# Altium project carte_alim.PrjPCB
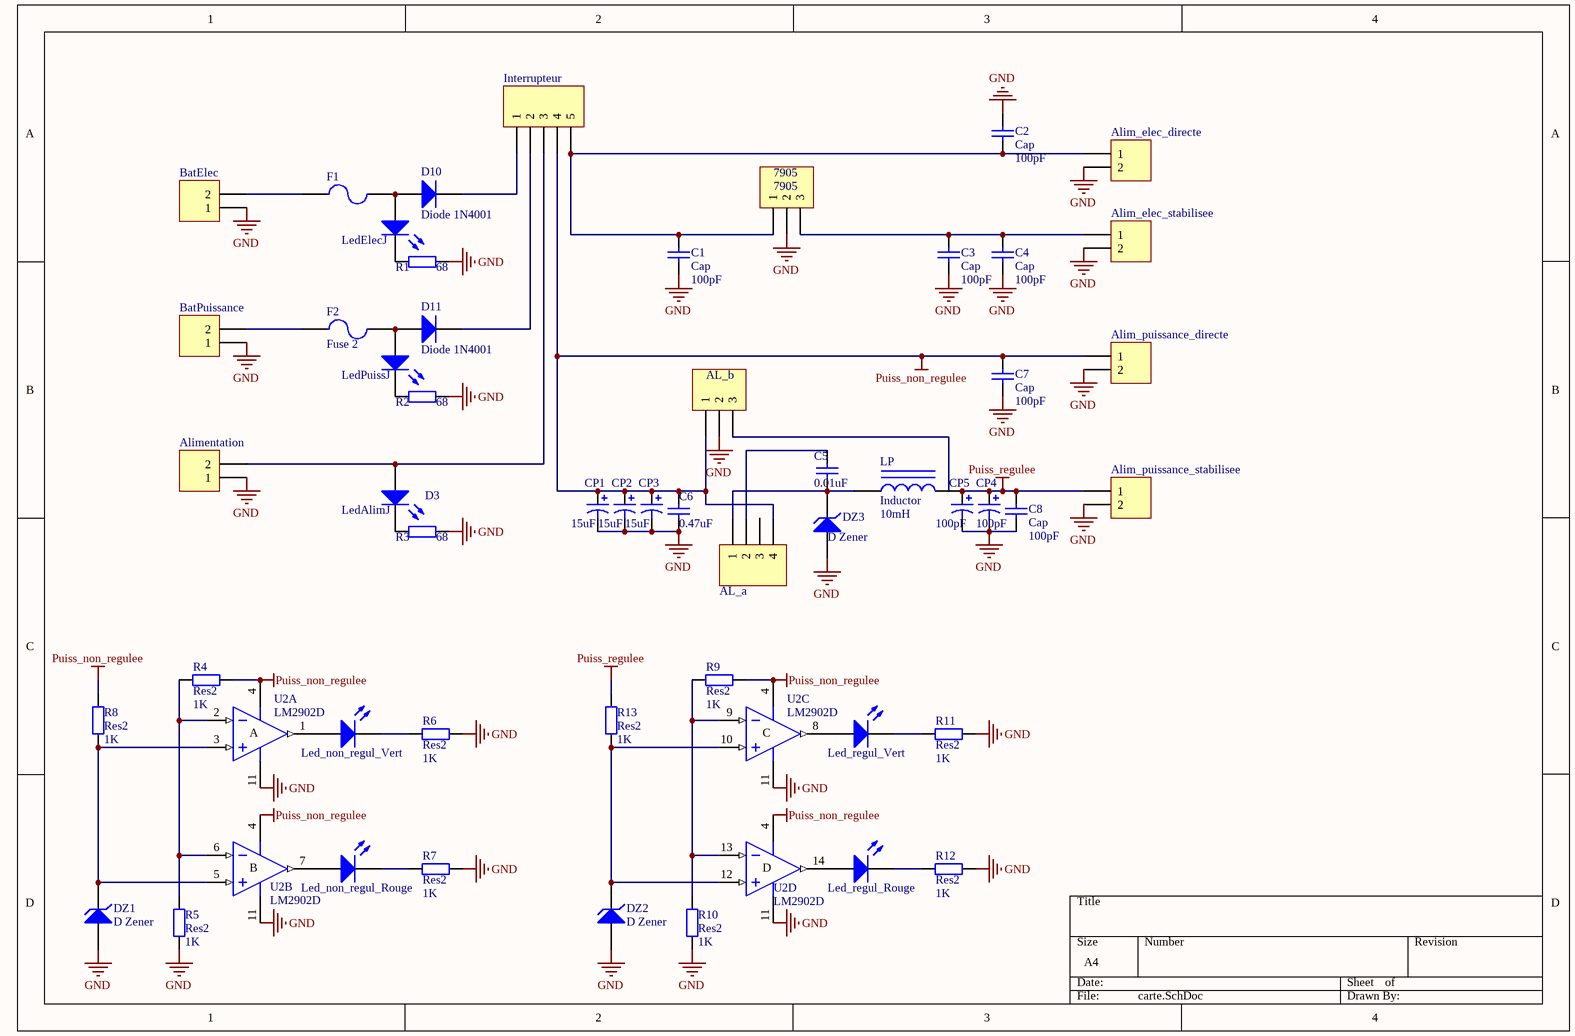
[diagram p0: carte.SchDoc]
1 sheet, 53 parts. Net scope: global (net labels, ports and power ports of the same name join across sheets).

## Sheet carte.SchDoc
size A4

### Parts
7905  7905  [MHDR1X3]
AL_a  Header 4  [HDR1X4]  (value not drawn)
AL_b  Header 3  [HDR1X3]  (value not drawn)
Alim_elec_directe  Header 2  [HDR1X2]  (value not drawn)
Alim_elec_stabilisee  Header 2  [HDR1X2]  (value not drawn)
Alim_puissance_directe  Header 2  [HDR1X2]  (value not drawn)
Alim_puissance_stabilisee  Header 2  [HDR1X2]  (value not drawn)
Alimentation  Header 2  [HDR1X2]  (value not drawn)
BatElec  Header 2  [HDR1X2]  (value not drawn)
BatPuissance  Header 2  [HDR1X2]  (value not drawn)
C1  Cap  value 100pF  [RAD-0.3]
C2  Cap  value 100pF  [RAD-0.3]
C3  Cap  value 100pF  [RAD-0.3]
C4  Cap  value 100pF  [RAD-0.3]
C5  value 0.01uF  [RAD-0.3]  (hidden comment: Cap)
C6  value 0.47uF  [RAD-0.3]  (hidden comment: Cap)
C7  Cap  value 100pF  [RAD-0.3]
C8  Cap  value 100pF  [RAD-0.3]
CP1  value 15uF  [RB7.6-15]  (hidden comment: Cap Pol1)
CP2  value 15uF  [RB7.6-15]  (hidden comment: Cap Pol1)
CP3  value 15uF  [RB7.6-15]  (hidden comment: Cap Pol1)
CP4  value 100pF  [RB7.6-15]  (hidden comment: Cap Pol1)
CP5  value 100pF  [RB7.6-15]  (hidden comment: Cap Pol1)
D3  LedAlimJ  [LED-1]
D10  Diode 1N4001  [DO-41]
D11  Diode 1N4001  [DO-41]
DZ1  D Zener  [DIODE-0.7]
DZ2  D Zener  [DIODE-0.7]
DZ3  D Zener  [DIODE-0.7]
F1  Fuse 2  [PIN-W2/E2.8]  (value not drawn)
F2  Fuse 2  [PIN-W2/E2.8]
Interrupteur  Header 5  [HDR1X5]  (value not drawn)
Led_non_regul_Rouge  LED1  [LED-1]  (value not drawn)
Led_non_regul_Vert  LED1  [LED-1]  (value not drawn)
Led_regul_Rouge  LED1  [LED-1]  (value not drawn)
Led_regul_Vert  LED1  [LED-1]  (value not drawn)
LedElecJ  LED1  [LED-1]  (value not drawn)
LedPuissJ  LED1  [LED-1]  (value not drawn)
LP  Inductor  value 10mH  [AXIAL-0.9]
R1  value 68  [AXIAL-0.4]  (hidden comment: Res2)
R2  value 68  [AXIAL-0.4]  (hidden comment: Res2)
R3  value 68  [AXIAL-0.4]  (hidden comment: Res2)
R4  Res2  value 1K  [AXIAL-0.4]
R5  Res2  value 1K  [AXIAL-0.4]
R6  Res2  value 1K  [AXIAL-0.4]
R7  Res2  value 1K  [AXIAL-0.4]
R8  Res2  value 1K  [AXIAL-0.4]
R9  Res2  value 1K  [AXIAL-0.4]
R10  Res2  value 1K  [AXIAL-0.4]
R11  Res2  value 1K  [AXIAL-0.4]
R12  Res2  value 1K  [AXIAL-0.4]
R13  Res2  value 1K  [AXIAL-0.4]
U2  LM2902D  [D014_N]  (parts A,B,C,D of 4)

### Nets
GND: 7905.2 AL_b.2 Alim_elec_directe.2 Alim_elec_stabilisee.2 Alim_puissance_directe.2 Alim_puissance_stabilisee.2 Alimentation.1 BatElec.1 BatPuissance.1 C1.1 C2.2 C3.1 C4.1 C6.1 C7.1 C8.1 CP1.2 CP2.2 CP3.2 CP4.2 CP5.2 DZ1.1(A) DZ2.1(A) DZ3.1(A) R1.2 R2.2 R3.2 R5.1 R6.2 R7.2 R10.1 R11.2 R12.2 U2.11(V-)
Puiss_non_regulee: AL_a.1(4) AL_b.1 Alim_puissance_directe.1 C6.2 C7.2 CP1.1 CP2.1 CP3.1 Interrupteur.4 R4.1 R8.2 R9.1 U2.4(V+)
Puiss_regulee: Alim_puissance_stabilisee.1 C8.2 CP4.1 CP5.1 LP.2 R13.2
Net7905_1: 7905.1 Alim_elec_directe.1 C1.2 C2.1 Interrupteur.5
Net7905_3: 7905.3 Alim_elec_stabilisee.1 C3.2 C4.2
NetAL_a_3: AL_a.3(2) C5.2
NetAL_a_4: AL_a.4(1) C5.1 DZ3.2(K) LP.1
NetAlimentation_2: Alimentation.2 D3.1(A) Interrupteur.3
NetBatElec_2: BatElec.2 F1.1
NetBatPuissance_2: BatPuissance.2 F2.1
NetD3_2: D3.2(K) R3.1
NetD10_1: D10.1(A) F1.2 LedElecJ.1(A)
NetD10_2: D10.2(K) Interrupteur.1
NetD11_1: D11.1(A) F2.2 LedPuissJ.1(A)
NetD11_2: D11.2(K) Interrupteur.2
NetDZ1_2: DZ1.2(K) R8.1 U2.3(IN+) U2.5(IN+)
NetDZ2_2: DZ2.2(K) R13.1 U2.10(IN+) U2.12(IN+)
NetLed_non_regul_Rouge_1: Led_non_regul_Rouge.1(A) U2.7(OUT)
NetLed_non_regul_Rouge_2: Led_non_regul_Rouge.2(K) R7.1
NetLed_non_regul_Vert_1: Led_non_regul_Vert.1(A) U2.1(OUT)
NetLed_non_regul_Vert_2: Led_non_regul_Vert.2(K) R6.1
NetLed_regul_Rouge_1: Led_regul_Rouge.1(A) U2.14(OUT)
NetLed_regul_Rouge_2: Led_regul_Rouge.2(K) R12.1
NetLed_regul_Vert_1: Led_regul_Vert.1(A) U2.8(OUT)
NetLed_regul_Vert_2: Led_regul_Vert.2(K) R11.1
NetLedElecJ_2: LedElecJ.2(K) R1.1
NetLedPuissJ_2: LedPuissJ.2(K) R2.1
NetR4_2: R4.2 R5.2 U2.2(IN-) U2.6(IN-)
NetR9_2: R9.2 R10.2 U2.9(IN-) U2.13(IN-)

Not connected (* = marked no-connect by the designer): AL_a 2(3); AL_b 3

### Notes on the sheet
- (in symbol LM2902D, part A) A
- (in symbol LM2902D, part B) B
- (in symbol LM2902D, part C) C
- (in symbol LM2902D, part D) D

### Library data of the parts
7905 = MHDR1X3: Header, 3-Pin; LatestRevisionDate: 17-Jul-2002; LatestRevisionNote: Re-released for DXP Platform.; Publisher: Altium Limited
AL_a = Header 4: Header, 4-Pin; LatestRevisionDate: 17-Jul-2002; LatestRevisionNote: Re-released for DXP Platform.; Publisher: Altium Limited
AL_b = Header 3: Header, 3-Pin; LatestRevisionDate: 17-Jul-2002; LatestRevisionNote: Re-released for DXP Platform.; Publisher: Altium Limited
Alim_elec_directe Alim_elec_stabilisee Alim_puissance_directe Alim_puissance_stabilisee Alimentation BatElec BatPuissance = Header 2: Header, 2-Pin; LatestRevisionDate: 17-Jul-2002; LatestRevisionNote: Re-released for DXP Platform.; Publisher: Altium Limited
C1-C8 = Cap: Capacitor; Published: 8-Jun-2000; LatestRevisionDate: 17-Jul-2002; LatestRevisionNote: Re-released for DXP Platform.; PackageReference: RAD-0.3; Publisher: Altium Limited; PackageDescription: Radial Cap, Thru-Hole; 2 Leads; 0.3 in Pin Spacing
CP1-CP5 = Cap Pol1: Polarized Capacitor (Radial); Published: 8-Jun-2000; LatestRevisionDate: 17-Jul-2002; LatestRevisionNote: Re-released for DXP Platform.; PackageReference: RB7.6-15; Publisher: Altium Limited; PackageDescription: Polarized Capacitor (Radial); 2 Leads
D3 Led_non_regul_Rouge Led_non_regul_Vert Led_regul_Rouge Led_regul_Vert LedElecJ LedPuissJ = LED1: Typical RED GaAs LED; Published: 8-Jun-2000; LatestRevisionDate: 08-Jul-2005; LatestRevisionNote: Mech Layer 1 removed.; PackageReference: LED-1; Publisher: Altium Limited; PackageDescription: LED; 2 Leads
D10 D11 = Diode 1N4001: 1 Amp General Purpose Rectifier; Published: 8-Jun-2000; LatestRevisionDate: 17-Jul-2002; LatestRevisionNote: Re-released for DXP Platform.; DatasheetVersion: 1998; PackageVersion: Aug-1999; PackageReference: DO-41; Publisher: Altium Limited; PackageDescription: Diode, Axial; Body 5.2 x 2.7 mm (LxDia. max), Lead Dia. 0.86 mm (max); Code_JEDEC: DO-204-AL; ComponentLink1Description: Manufacturer Link; ComponentLink1URL: http://www.fairchildsemi.com/; ComponentLink2Description: Datasheet; ComponentLink2URL: http://www.fairchildsemi.com/ds/1N%2F1N4001.pdf
DZ1-DZ3 = D Zener: Zener Diode; Published: 8-Jun-2000; LatestRevisionDate: 17-Jul-2002; LatestRevisionNote: Re-released for DXP Platform.; PackageReference: DIODE-0.7; Publisher: Altium Limited; PackageDescription: Diode, Thru-Hole; 2 Leads; 0.7 in Pin Spacing
F1 F2 = Fuse 2: Fuse; Published: 8-Jun-2000; LatestRevisionDate: 17-Jul-2002; LatestRevisionNote: Re-released for DXP Platform.; PackageReference: PIN-W2/E2.8; Publisher: Altium Limited; PackageDescription: Thru-Hole; 2 Leads
Interrupteur = Header 5: Header, 5-Pin; LatestRevisionDate: 17-Jul-2002; LatestRevisionNote: Re-released for DXP Platform.; Publisher: Altium Limited
LP = Inductor Iron: Magnetic-Core Inductor; Published: 24-Mar-1999; LatestRevisionDate: 17-Jul-2002; LatestRevisionNote: Re-released for DXP Platform.; PackageReference: AXIAL-0.9; Publisher: Altium Limited; PackageDescription: Axial Device, Thru-Hole; 2 Leads; 0.9 in Pin Spacing
R1-R13 = Res2: Resistor; Published: 8-Jun-2000; LatestRevisionDate: 17-Jul-2002; LatestRevisionNote: Re-released for DXP Platform.; PackageReference: AXIAL-0.4; Publisher: Altium Limited; PackageDescription: Axial Device, Thru-Hole; 2 Leads; 0.4 in Pin Spacing
U2 = LM2902D: Quadruple Operational Amplifier; Published: 16-Jan-2001; LatestRevisionDate: 13-Apr-2006; LatestRevisionNote: IPC-7351 Footprint Added.; DatasheetVersion: Feb-1997; PackageVersion: Jan-1998; PackageReference: D014; Publisher: Altium Limited; PackageDescription: 14-Pin Small Outline Integrated Circuit 1.27 mm Pitch; Code_IPC: SOIC127P600-14; ComponentLink1Description: Manufacturer Link; ComponentLink1URL: http://www.ti.com/; ComponentLink2Description: Datasheet; ComponentLink2URL: http://www-s.ti.com/sc/ds/lm2902.pdf